# Altium schematic sheet Sheet.SchDoc
size A3
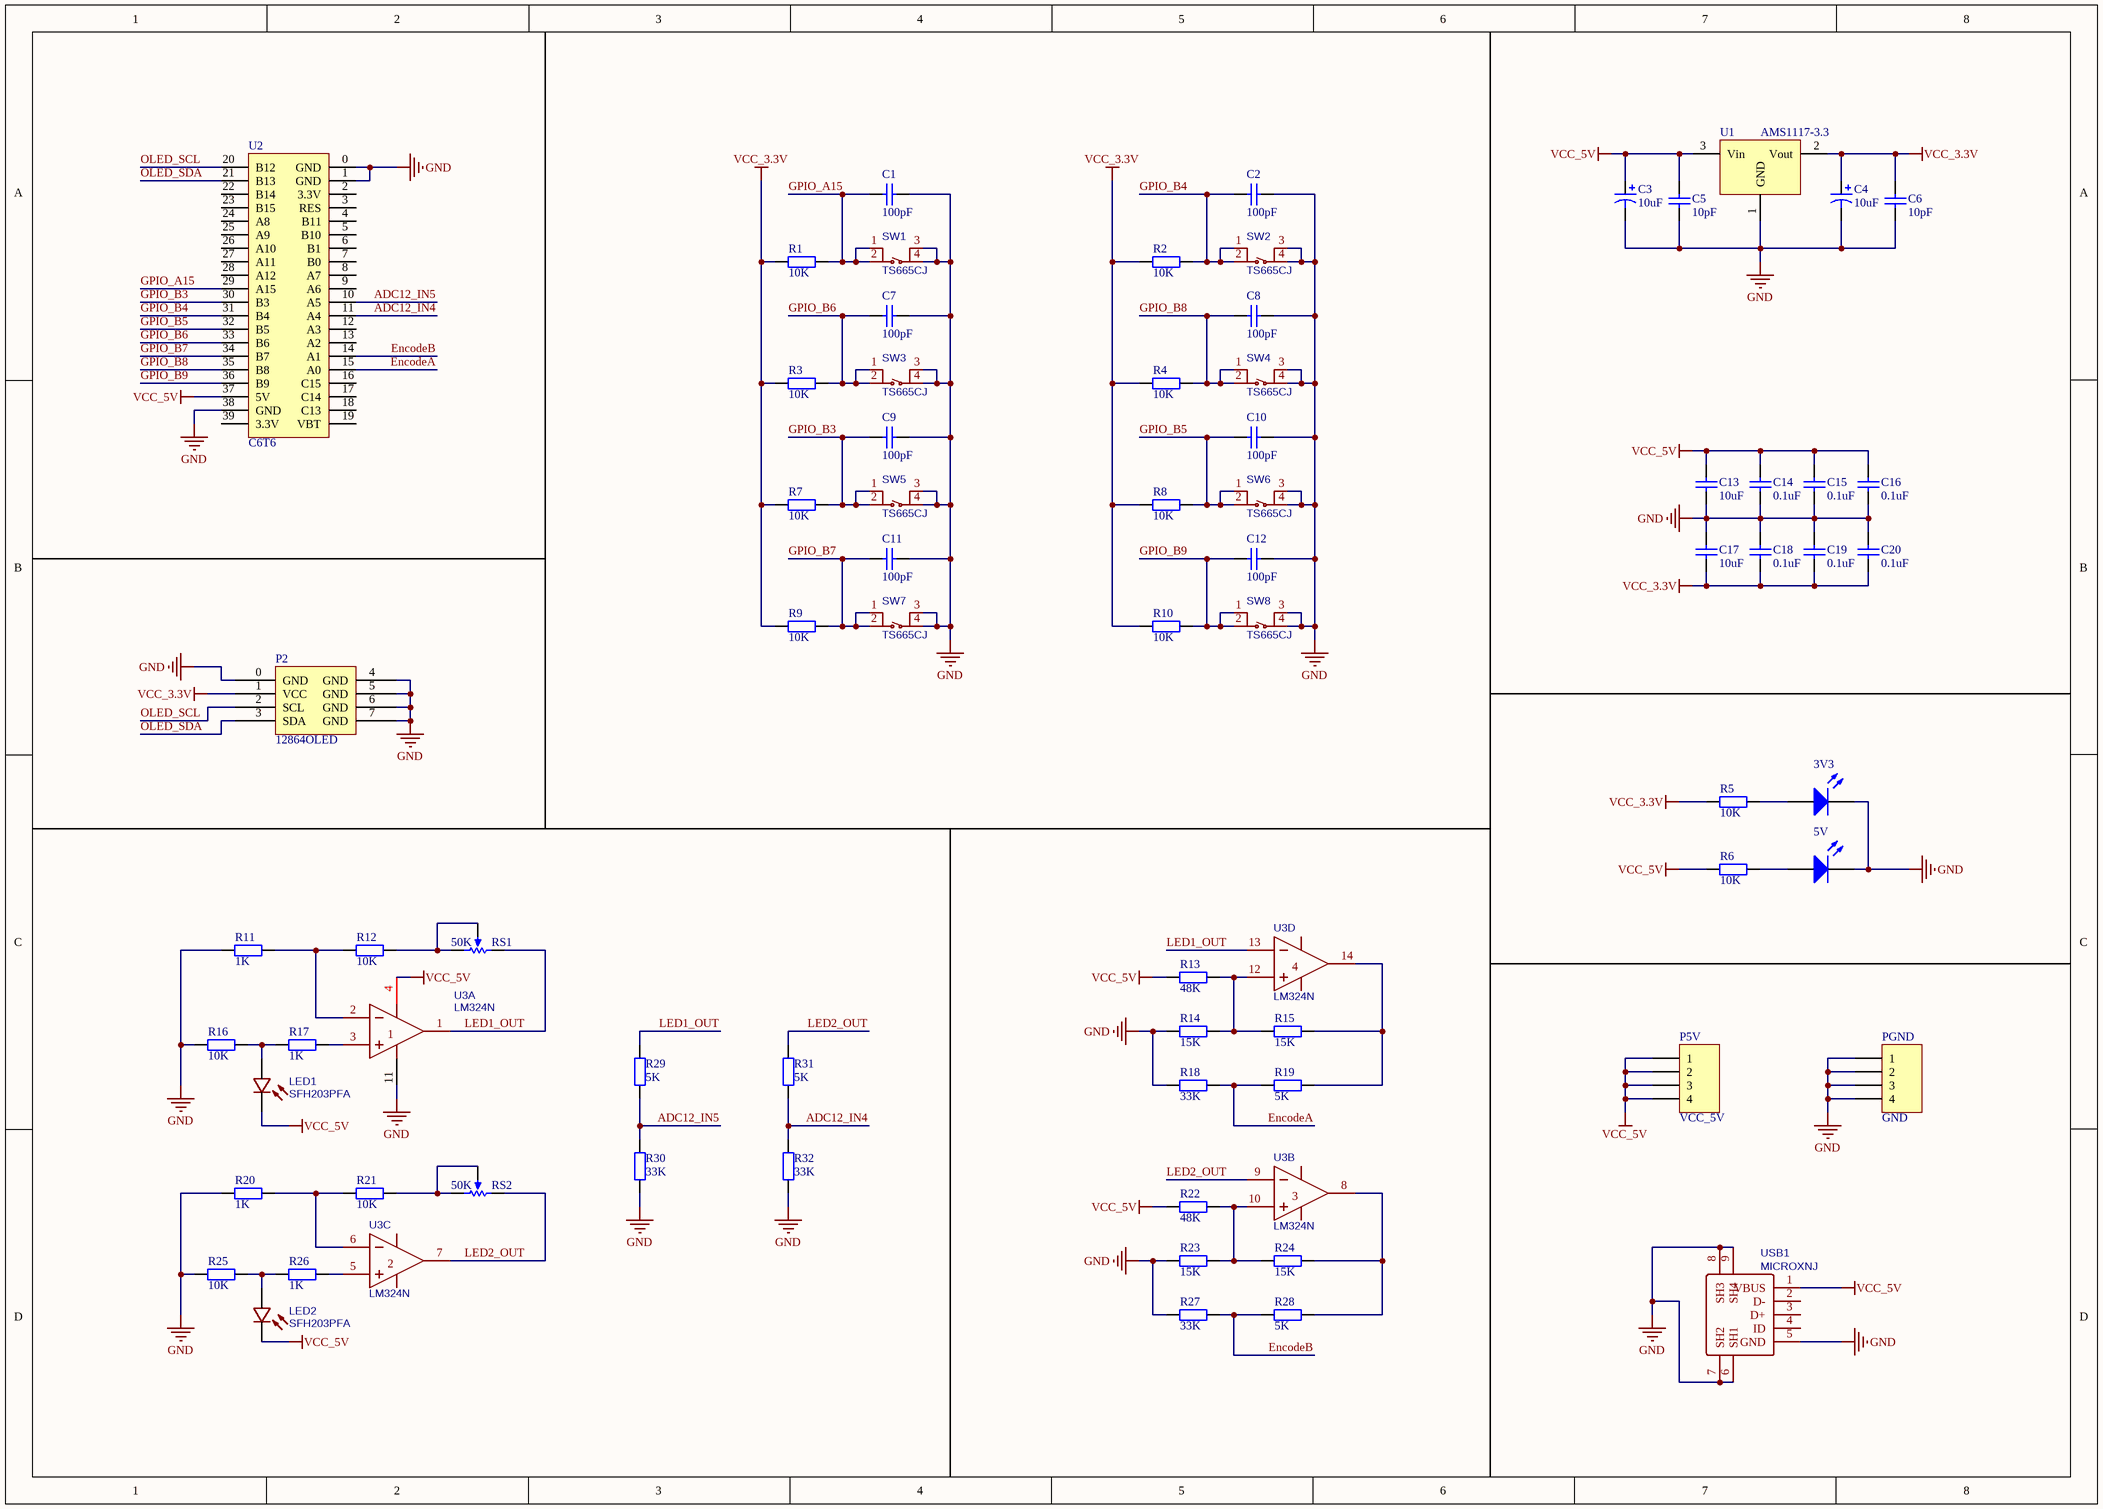
[diagram p0: Sheet.SchDoc]

## Parts
3V3  (no value)  [6-0805_M]
5V  (no value)  [6-0805_M]
C1  value 100pF  [CAP-LISHI]  (hidden comment: Cap Semi)
C2  value 100pF  [CAP-LISHI]  (hidden comment: Cap Semi)
C3  value 10uF  [CAP-LISHI]  (hidden comment: Cap Pol3)
C4  value 10uF  [CAP-LISHI]  (hidden comment: Cap Pol3)
C5  value 10pF  [CAP-LISHI]  (hidden comment: Cap Semi)
C6  value 10pF  [CAP-LISHI]  (hidden comment: Cap Semi)
C7  value 100pF  [CAP-LISHI]  (hidden comment: Cap Semi)
C8  value 100pF  [CAP-LISHI]  (hidden comment: Cap Semi)
C9  value 100pF  [CAP-LISHI]  (hidden comment: Cap Semi)
C10  value 100pF  [CAP-LISHI]  (hidden comment: Cap Semi)
C11  value 100pF  [CAP-LISHI]  (hidden comment: Cap Semi)
C12  value 100pF  [CAP-LISHI]  (hidden comment: Cap Semi)
C13  value 10uF  [CAP-LISHI]  (hidden comment: Cap Semi)
C14  value 0.1uF  [CAP-LISHI]  (hidden comment: Cap Semi)
C15  value 0.1uF  [CAP-LISHI]  (hidden comment: Cap Semi)
C16  value 0.1uF  [CAP-LISHI]  (hidden comment: Cap Semi)
C17  value 10uF  [CAP-LISHI]  (hidden comment: Cap Semi)
C18  value 0.1uF  [CAP-LISHI]  (hidden comment: Cap Semi)
C19  value 0.1uF  [CAP-LISHI]  (hidden comment: Cap Semi)
C20  value 0.1uF  [CAP-LISHI]  (hidden comment: Cap Semi)
LED1  SFH203PFA  [LED-TH_BD5.9-P2.54-FD]
LED2  SFH203PFA  [LED-TH_BD5.9-P2.54-FD]
P2  12864OLED  [12864_0.96_OLED]
P5V  VCC_5V  [HDR1X4]
PGND  GND  [HDR1X4]
R1  value 10K  [AXIAL-0.4]  (hidden comment: Res2)
R2  value 10K  [AXIAL-0.4]  (hidden comment: Res2)
R3  value 10K  [AXIAL-0.4]  (hidden comment: Res2)
R4  value 10K  [AXIAL-0.4]  (hidden comment: Res2)
R5  value 10K  [AXIAL-0.4]  (hidden comment: Res2)
R6  value 10K  [AXIAL-0.4]  (hidden comment: Res2)
R7  value 10K  [AXIAL-0.4]  (hidden comment: Res2)
R8  value 10K  [AXIAL-0.4]  (hidden comment: Res2)
R9  value 10K  [AXIAL-0.4]  (hidden comment: Res2)
R10  value 10K  [AXIAL-0.4]  (hidden comment: Res2)
R11  value 1K  [AXIAL-0.4]  (hidden comment: Res2)
R12  value 10K  [AXIAL-0.4]  (hidden comment: Res2)
R13  value 48K  [AXIAL-0.4]  (hidden comment: Res2)
R14  value 15K  [AXIAL-0.4]  (hidden comment: Res2)
R15  value 15K  [AXIAL-0.4]  (hidden comment: Res2)
R16  value 10K  [AXIAL-0.4]  (hidden comment: Res2)
R17  value 1K  [AXIAL-0.4]  (hidden comment: Res2)
R18  value 33K  [AXIAL-0.4]  (hidden comment: Res2)
R19  value 5K  [AXIAL-0.4]  (hidden comment: Res2)
R20  value 1K  [AXIAL-0.4]  (hidden comment: Res2)
R21  value 10K  [AXIAL-0.4]  (hidden comment: Res2)
R22  value 48K  [AXIAL-0.4]  (hidden comment: Res2)
R23  value 15K  [AXIAL-0.4]  (hidden comment: Res2)
R24  value 15K  [AXIAL-0.4]  (hidden comment: Res2)
R25  value 10K  [AXIAL-0.4]  (hidden comment: Res2)
R26  value 1K  [AXIAL-0.4]  (hidden comment: Res2)
R27  value 33K  [AXIAL-0.4]  (hidden comment: Res2)
R28  value 5K  [AXIAL-0.4]  (hidden comment: Res2)
R29  value 5K  [AXIAL-0.4]  (hidden comment: Res2)
R30  value 33K  [AXIAL-0.4]  (hidden comment: Res2)
R31  value 5K  [AXIAL-0.4]  (hidden comment: Res2)
R32  value 33K  [AXIAL-0.4]  (hidden comment: Res2)
RS1  value 50K  [RES-ADJ-TH_3P-L10.0-W10.0-P2.50-L]  (hidden comment: RPot)
RS2  value 50K  [RES-ADJ-TH_3P-L10.0-W10.0-P2.50-L]  (hidden comment: RPot)
SW1  TS665CJ  [SW-TH_4P-L6.0-W6.0-P4.50-LS6.5]
SW2  TS665CJ  [SW-TH_4P-L6.0-W6.0-P4.50-LS6.5]
SW3  TS665CJ  [SW-TH_4P-L6.0-W6.0-P4.50-LS6.5]
SW4  TS665CJ  [SW-TH_4P-L6.0-W6.0-P4.50-LS6.5]
SW5  TS665CJ  [SW-TH_4P-L6.0-W6.0-P4.50-LS6.5]
SW6  TS665CJ  [SW-TH_4P-L6.0-W6.0-P4.50-LS6.5]
SW7  TS665CJ  [SW-TH_4P-L6.0-W6.0-P4.50-LS6.5]
SW8  TS665CJ  [SW-TH_4P-L6.0-W6.0-P4.50-LS6.5]
U1  AMS1117-3.3  [SOT-89-3_L4.5-W2.5-P1.50-LS4.2-BR]
U2  C6T6  [STM32F103C6T6]
U3  LM324N  [DIP-14_L19.4-W6.4-P2.54-LS7.6-BL]  (parts A,B,C,D of 4)
USB1  MICROXNJ  [MICRO-USB-SMD_MICROXNJ]

## Nets
GND: 3V3.2(K) 5V.2(K) C1.2 C2.2 C3.2 C4.2 C5.1 C6.1 C7.2 C8.2 C9.2 C10.2 C11.2 C12.2 C13.1 C14.1 C15.1 C16.1 C17.1 C18.1 C19.1 C20.1 P2.0(GND) P2.4(GND) P2.5(GND) P2.6(GND) P2.7(GND) PGND.1 PGND.2 PGND.3 PGND.4 R11.1 R14.2 R16.1 R18.1 R20.1 R23.2 R25.1 R27.1 R30.1 R32.1 SW1.3(C) SW1.4(D) SW2.3(C) SW2.4(D) SW3.3(C) SW3.4(D) SW4.3(C) SW4.4(D) SW5.3(C) SW5.4(D) SW6.3(C) SW6.4(D) SW7.3(C) SW7.4(D) SW8.3(C) SW8.4(D) U1.1(GND) U2.0(GND) U2.1(GND) U2.38(GND) U3.11(GND) USB1.5(GND) USB1.6(SH1) USB1.7(SH2) USB1.8(SH3) USB1.9(SH4)
VCC_3.3V: C4.1 C6.2 C17.2 C18.2 C19.2 C20.2 P2.1(VCC) R1.1 R2.1 R3.1 R4.1 R5.1 R7.1 R8.1 R9.1 R10.1 U1.2(Vout)
VCC_5V: C3.1 C5.2 C13.2 C14.2 C15.2 C16.2 LED1.2(E) LED2.2(E) P5V.1 P5V.2 P5V.3 P5V.4 R6.1 R13.2 R22.2 U1.3(Vin) U2.37(5V) U3.4(VCC) USB1.1(VBUS)
ADC12_IN4: R31.1 R32.2 U2.11(A4)
ADC12_IN5: R29.1 R30.2 U2.10(A5)
EncodeA: R18.2 R19.1 U2.15(A0)
EncodeB: R27.2 R28.1 U2.14(A1)
GPIO_A15: C1.1 R1.2 SW1.1(A) SW1.2(B) U2.29(A15)
GPIO_B3: C9.1 R7.2 SW5.1(A) SW5.2(B) U2.30(B3)
GPIO_B4: C2.1 R2.2 SW2.1(A) SW2.2(B) U2.31(B4)
GPIO_B5: C10.1 R8.2 SW6.1(A) SW6.2(B) U2.32(B5)
GPIO_B6: C7.1 R3.2 SW3.1(A) SW3.2(B) U2.33(B6)
GPIO_B7: C11.1 R9.2 SW7.1(A) SW7.2(B) U2.34(B7)
GPIO_B8: C8.1 R4.2 SW4.1(A) SW4.2(B) U2.35(B8)
GPIO_B9: C12.1 R10.2 SW8.1(A) SW8.2(B) U2.36(B9)
LED1_OUT: R29.2 RS1.1(TOP) U3.1(OUT1) U3.13(IN4-)
LED2_OUT: R31.2 RS2.1(TOP) U3.7(OUT2) U3.9(IN3-)
OLED_SCL: P2.2(SCL) U2.20(B12)
OLED_SDA: P2.3(SDA) U2.21(B13)
Net3V3_1: 3V3.1(A) R5.2
Net5V_1: 5V.1(A) R6.2
NetLED1_1: LED1.1(C) R16.2 R17.1
NetLED2_1: LED2.1(C) R25.2 R26.1
NetR11_2: R11.2 R12.1 U3.2(IN1-)
NetR12_2: R12.2 RS1.2(BOT) RS1.3(TAP)
NetR13_1: R13.1 R14.1 R15.2 U3.12(IN4+)
NetR15_1: R15.1 R19.2 U3.14(OUT4)
NetR17_2: R17.2 U3.3(IN1+)
NetR20_2: R20.2 R21.1 U3.6(IN2-)
NetR21_2: R21.2 RS2.2(BOT) RS2.3(TAP)
NetR22_1: R22.1 R23.1 R24.2 U3.10(IN3+)
NetR24_1: R24.1 R28.2 U3.8(OUT3)
NetR26_2: R26.2 U3.5(IN2+)

Not connected (* = marked no-connect by the designer): U2 2(3.3V) 3(RES) 4(B11) 5(B10) 6(B1) 7(B0) 8(A7) 9(A6) 12(A3) 13(A2) 16(C15) 17(C14) 18(C13) 19(VBT) 22(B14) 23(B15) 24(A8) 25(A9) 26(A10) 27(A11) 28(A12) 39(3.3V); USB1 2(D-) 3(D+) 4(ID)

## Library data of the parts
3V3 5V = LED3: Typical BLUE SiC LED; Published: 8-Jun-2000; LatestRevisionDate: 17-Dec-2003; LatestRevisionNote: PCB Footprint replaced.; DatasheetVersion: 16-Apr-2002; PackageVersion: 16-Apr-2002; PackageReference: 3.5X2.8X1.9; Publisher: Altium Limited; PackageDescription: SM LED; 2 C-Bend Leads; Body 3.5 x 2.8 x 1.9 mm, inc leads (LxWxH typ)
C1 C2 C5-C20 = Cap Semi: Capacitor (Semiconductor SIM Model); Published: 8-Jun-2000; LatestRevisionDate: 29-May-2009; LatestRevisionNote: IPC-7351 Footprint Added.; PackageReference: C1206; Publisher: Altium Limited; PackageDescription: Chip Capacitor
C3 C4 = Cap Pol3: Polarized Capacitor (Surface Mount); Published: 8-Jun-2000; LatestRevisionDate: 29-May-2009; LatestRevisionNote: IPC-7351 Footprint Added.; PackageReference: C0805; Publisher: Altium Limited; PackageDescription: Chip Capacitor
LED1 LED2 = SFH203PFA: BOM_Manufacturer: OSRAM Opto Semicon; Contributor: LCSC; BOM_Supplier: LCSC; BOM_Supplier Part: C554984; BOM_Manufacturer Part: SFH203PFA; BOM_JLCPCB Part Class: Extended Part; spicePre: L; spiceSymbolName: SFH203PFA
P5V PGND = Header 4: Header, 4-Pin; LatestRevisionDate: 17-Jul-2002; LatestRevisionNote: Re-released for DXP Platform.; Publisher: Altium Limited
R1-R32 = Res2: Resistor; Published: 8-Jun-2000; LatestRevisionDate: 17-Jul-2002; LatestRevisionNote: Re-released for DXP Platform.; PackageReference: AXIAL-0.4; Publisher: Altium Limited; PackageDescription: Axial Device, Thru-Hole; 2 Leads; 0.4 in Pin Spacing
RS1 RS2 = RPot: Potentiometer; Sim Note: Enter the Resistance value and the set point into parameter fields.; Set Position: 0.5; Published: 8-Jun-2000; LatestRevisionDate: 17-Jul-2002; LatestRevisionNote: Re-released for DXP Platform.; PackageReference: VR5; Publisher: Altium Limited; PackageDescription: Variable Resistor, Thru-Hole; 3 Leads
SW1-SW8 = TS665CJ: BOM_Manufacturer: SHOU HAN; Contributor: LCSC; BOM_Supplier: LCSC; BOM_Supplier Part: C393938; BOM_Manufacturer Part: TS665CJ; BOM_JLCPCB Part Class: Extended Part; spicePre: S; spiceSymbolName: TS665CJ
U1 = AMS1117-3.3_C880752
U2 = STM32F103C6T6
U3 = LM324N: BOM_Manufacturer: HGSEMI; subpart_no: 1; BOM_Supplier: LCSC; BOM_Supplier Part: C725320; BOM_Manufacturer Part: LM324N; BOM_JLCPCB Part Class: Extended Part; spicePre: U; spiceSymbolName: LM324N_C725320
USB1 = MICROXNJ: BOM_Manufacturer: SHOU HAN; Contributor: LCSC; BOM_Supplier: LCSC; BOM_Supplier Part: C404969; BOM_Manufacturer Part: MicroXNJ; BOM_JLCPCB Part Class: Extended Part; spicePre: U; spiceSymbolName: MICROXNJ